# Altium schematic sheet CAN_FD_INTERFACE.SchDoc
size B; SheetNumber: 4; SheetTotal: 7
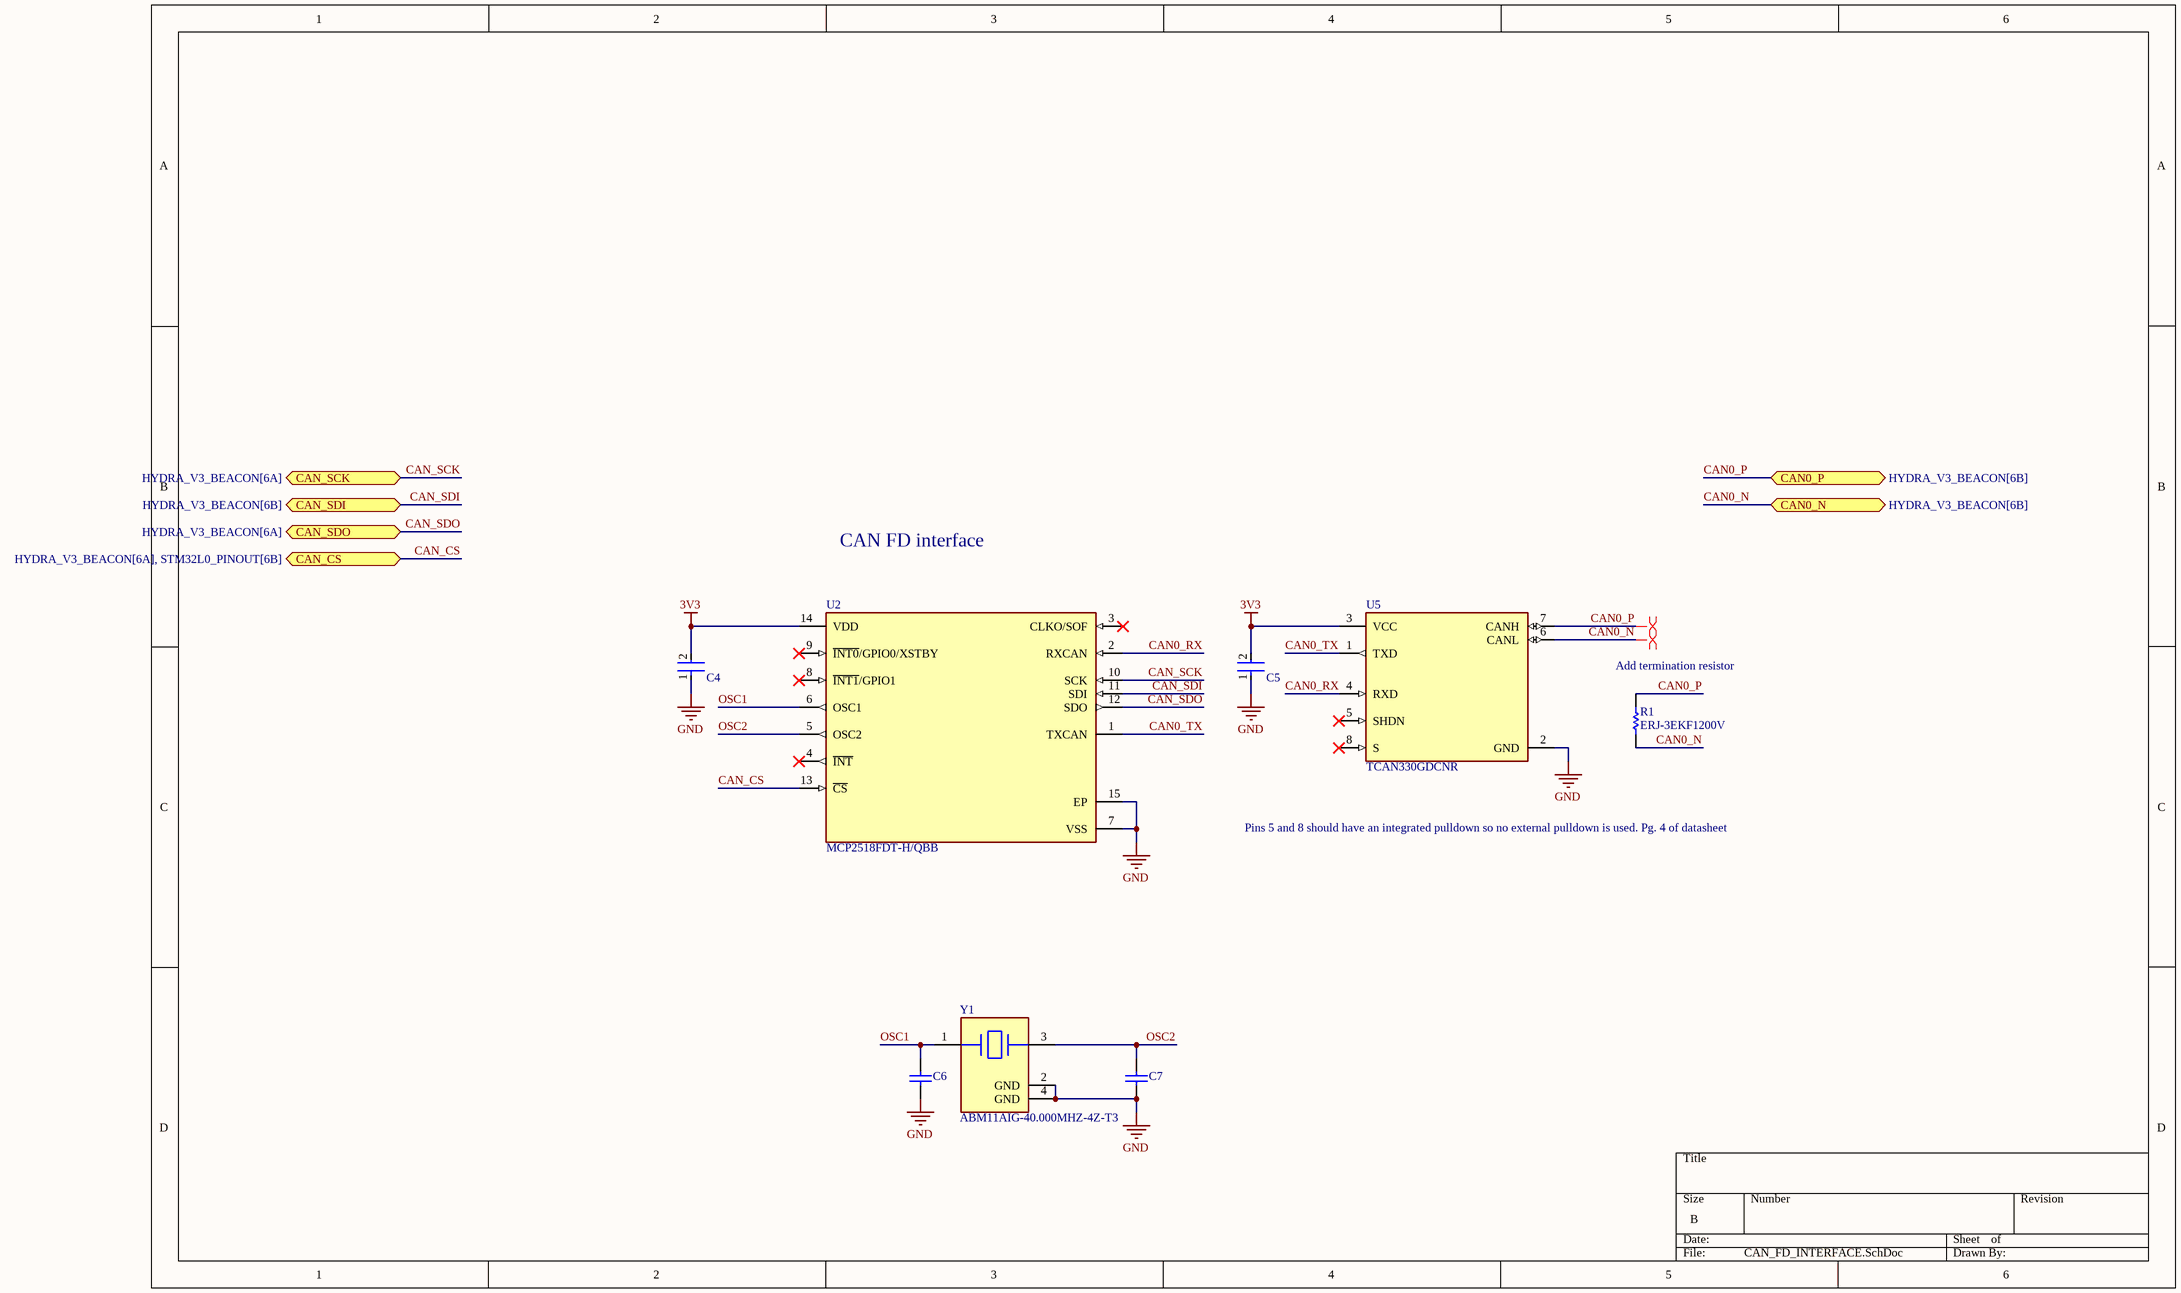
[diagram p0: CAN_FD_INTERFACE.SchDoc]

## Parts
C4  C0402C104K8PACTU  [FP-C0402-BB-MFG]  (value not drawn)
C5  C0402C104K8PACTU  [FP-C0402-BB-MFG]  (value not drawn)
C6  VJ0603D6R8CXPAJ  [CAPC1608X92X38LL15T08]  (value not drawn)
C7  VJ0603D6R8CXPAJ  [CAPC1608X92X38LL15T08]  (value not drawn)
R1  ERJ-3EKF1200V  [RESC1609X55X30ML15T15]
U2  MCP2518FDT-H/QBB  [FP-C04-21361-MFG]
U5  TCAN330GDCNR  [FP-DCN0008A-MFG]
Y1  ABM11AIG-40.000MHZ-4Z-T3  [FP-ABM11AIG-MFG]

## Ports
CAN0_N (bidir, see HYDRA_V3_BEACON[6B]), CAN0_P (bidir, see HYDRA_V3_BEACON[6B]), CAN_CS (bidir, see HYDRA_V3_BEACON[6A], STM32L0_PINOUT[6B]), CAN_SCK (bidir, see HYDRA_V3_BEACON[6A]), CAN_SDI (bidir, see HYDRA_V3_BEACON[6B]), CAN_SDO (bidir, see HYDRA_V3_BEACON[6A])

## Nets
3V3: C4.2 C5.2 U2.14(VDD) U5.3(VCC)
GND: C4.1 C5.1 C6.1 C7.1 U2.7(VSS) U2.15(EP) U5.2(GND) Y1.2(GND) Y1.4(GND)
CAN0_N: R1.1 U5.6(CANL) ; port CAN0_N
CAN0_P: R1.2 U5.7(CANH) ; port CAN0_P
CAN0_RX: U2.2(RXCAN) U5.4(RXD)
CAN0_TX: U2.1(TXCAN) U5.1(TXD)
CAN_CS: U2.13(~{CS}) ; port CAN_CS
CAN_SCK: U2.10(SCK) ; port CAN_SCK
CAN_SDI: U2.11(SDI) ; port CAN_SDI
CAN_SDO: U2.12(SDO) ; port CAN_SDO
OSC1: C6.2 U2.6(OSC1) Y1.1(1_Crystal)
OSC2: C7.2 U2.5(OSC2) Y1.3(2_Crystal)

Not connected (* = marked no-connect by the designer): U2 3(CLKO/SOF)* 4(~{INT})* 8(~{INT1}/GPIO1)* 9(~{INT0}/GPIO0/XSTBY)*; U5 5(SHDN)* 8(S)*

## Layout directives
differential pair: CAN0_N, CAN0_P

## Notes on the sheet
- CAN FD interface
- (near R1) Add termination resistor
- Pins 5 and 8 should have an integrated pulldown so no external pulldown is used. Pg. 4 of datasheet

## Library data of the parts
C4 C5 = CMP-2008-02046-2: CAP CER 0.1UF 10V X5R 0402; Manufacturer: Kemet; Material: Ceramic; Capacitance: 0.10 μF; Temperature Coefficient: 15%; Tolerance: 0.1; Value: 0.10 μF; Package: C0402-BB; Temperature: -55°C to +125°C; ComponentLink2Description: Datasheet; Temperature Characteristic: X5R; Device Class L1: Passive Components; Height: 0.55mm; Lead Free: Yes; ComponentLink2URL: https://content.kemet.com/datasheets/KEM_C1002_X7R_SMD.pdf; Device Class L2: Capacitors; Temperature Range Low: -55°C; Temperature Range High: +125°C; RoHS: TRUE; Octopart: https://octopart.com/c0402c104k8pactu-kemet-140039; Automotive: No; Mouser Description: Capacitor 100 nF 10 VDC 0402; Category: Cap; Voltage Rating: 10 V; Digikey Description: CAP CER 0.1UF 10V X5R 0402; Ipc Land Pattern Name: CAPC10050X50; Device Class L3: Ceramic Capacitors; Manufacturer Part Number: C0402C104K8PACTU
C6 C7 = CMP-2006-01956-1: Manufacturer: Vitramon; Part Number: VJ0603D6R8CXPAJ
R1 = CMP-2000-00213-2: Chip Resistor, 120 Ohm, +/- 1%, 0.1 W, -55 to 155 degC, 0603 (1608 Metric), RoHS, Tape and Reel; Manufacturer: Panasonic; Power Rating: 100mW; Voltage Rating (DC): 75V; Resistance: 120Ohm; Temperature Coefficient: 100ppm/degreesC; Number of Terminations: 2; Military Standard: Not; Tolerance: 1%; Min Operating Temperature: -55degC; Packaging: TapeandReel; Lead Free: LeadFree; Max Operating Temperature: 155degC; Manufacturer URL: http://www.panasonic.com/; Case Code (Imperial): 0603; REACH SVHC: NoSVHC; Width: 0.031inch; Datasheet URL: https://industrial.panasonic.com/cdbs/www-data/pdf/RDA0000/AOA0000C283.pdf; RoHSCompliant: true; Max Power Dissipation: 100mW; Termination: SMD/SMT; Package Reference: 0603; Height: 0.022inch; Depth: 0.8mm; Package Description: 2-Pin Surface Mount Device, Body 1.6 x 0.85 mm; Contact Plating: Tin; Length: 1.6mm; Package URL: http://www.st.com/st-web-ui/static/active/en/resource/technical/document/datasheet/CD00001320.pdf; Radiation Hardening: No; Package Quantity: 1; Number of Pins: 2; Datasheet Version: 42095.0; Voltage Rating: 75V; Composition: ThickFilm; Case/Package: 0603; Mount: SurfaceMount; Case Code (Metric): 1608
U2 = CMP-06298-000029-1: IC CAN CONTROLLER SPI 14VDFN; RoHS Compliant: Yes
U5 = CMP-04872-000178-1: IC TRANSCEIVER 1/1 SOT23-8; Data Rate: 1Mbps; Packaging: Tape and Reel; Min Operating Temperature: -40°C; Max Operating Temperature: 125°C; RoHS Compliant: Yes; Lead Free: Lead Free; Case/Package: SOT-23-8; Mount: Surface Mount
Y1 = CMP-27762-004352-1: Crystal 40MHz ±30ppm 10pF SMD-4 2mm x 1.6mm Automotive; ESR (Equivalent Series Resistance): 60R; Frequency Stability: 50ppm; Max Operating Temperature: 125°C; Ratings: AEC-Q200; Color: Yellow; Frequency: 40MHz; Width: 0.063inch; Packaging: Tape and Reel; RoHS Compliant: Yes; Case/Package: SMD/SMT; Load Capacitance: 10pF; Frequency Tolerance: 30ppm; Length: 0.079inch; Min Operating Temperature: -40°C; Mount: Surface Mount; Height: 0.022inch